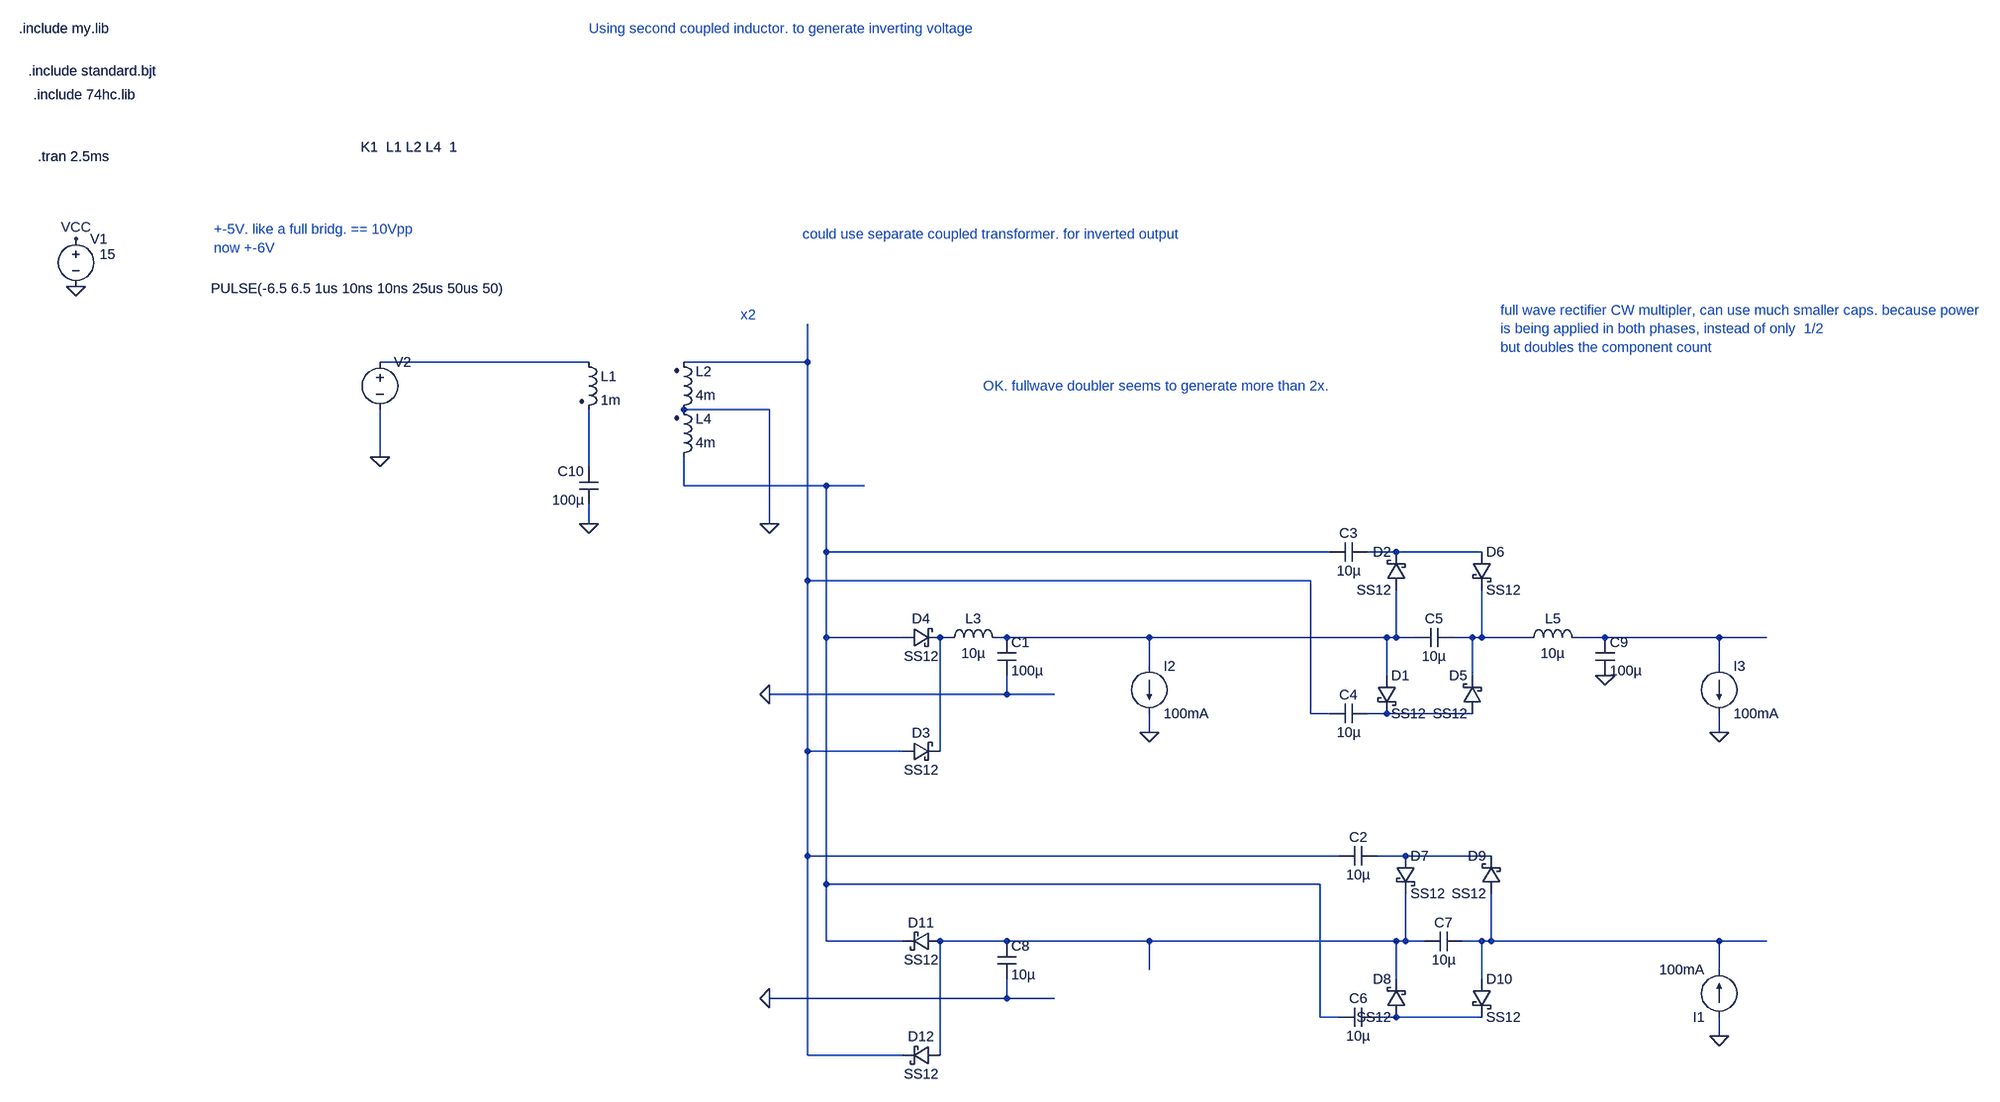
[diagram p0: schematic Draft29.asc]
Draft29.asc, the LTspice schematic file:
Version 4
SHEET 1 5720 1740
WIRE 1504 -128 1152 -128
WIRE 1872 -128 1872 -192
WIRE 1872 -128 1664 -128
WIRE 1808 -48 1664 -48
WIRE 1152 32 1152 -48
WIRE 1504 48 1504 -48
WIRE 1664 80 1664 32
WIRE 1904 80 1664 80
WIRE 1968 80 1904 80
WIRE 1504 144 1504 112
WIRE 1808 144 1808 -48
WIRE 1904 192 1904 80
WIRE 2752 192 1904 192
WIRE 2864 192 2816 192
WIRE 3008 192 2864 192
WIRE 1872 240 1872 -128
WIRE 2720 240 1872 240
WIRE 1904 336 1904 192
WIRE 2032 336 1904 336
WIRE 2112 336 2096 336
WIRE 2208 336 2192 336
WIRE 2448 336 2208 336
WIRE 2848 336 2448 336
WIRE 2864 336 2864 256
WIRE 2864 336 2848 336
WIRE 2896 336 2864 336
WIRE 2992 336 2960 336
WIRE 3008 336 3008 256
WIRE 3008 336 2992 336
WIRE 3088 336 3008 336
WIRE 3216 336 3168 336
WIRE 3408 336 3216 336
WIRE 3488 336 3408 336
WIRE 2448 384 2448 336
WIRE 3408 384 3408 336
WIRE 2848 400 2848 336
WIRE 2992 400 2992 336
WIRE 2208 432 2208 400
WIRE 2208 432 1808 432
WIRE 2288 432 2208 432
WIRE 2720 464 2720 240
WIRE 2752 464 2720 464
WIRE 2848 464 2816 464
WIRE 2992 464 2848 464
WIRE 2448 496 2448 464
WIRE 3408 496 3408 464
WIRE 1872 528 1872 240
WIRE 2032 528 1872 528
WIRE 2096 528 2096 336
WIRE 1872 704 1872 528
WIRE 2768 704 1872 704
WIRE 2880 704 2832 704
WIRE 3024 704 2880 704
WIRE 1904 752 1904 336
WIRE 2736 752 1904 752
WIRE 1904 848 1904 752
WIRE 2032 848 1904 848
WIRE 2208 848 2096 848
WIRE 2448 848 2208 848
WIRE 2864 848 2448 848
WIRE 2880 848 2880 768
WIRE 2880 848 2864 848
WIRE 2912 848 2880 848
WIRE 3008 848 2976 848
WIRE 3024 848 3024 768
WIRE 3024 848 3008 848
WIRE 3408 848 3024 848
WIRE 3488 848 3408 848
WIRE 2448 896 2448 848
WIRE 3408 896 3408 848
WIRE 2864 912 2864 848
WIRE 3008 912 3008 848
WIRE 2208 944 2208 912
WIRE 2208 944 1808 944
WIRE 2288 944 2208 944
WIRE 2736 976 2736 752
WIRE 2768 976 2736 976
WIRE 2864 976 2832 976
WIRE 3008 976 2864 976
WIRE 3408 1008 3408 976
WIRE 1872 1040 1872 704
WIRE 2032 1040 1872 1040
WIRE 2096 1040 2096 848
FLAG 1808 144 0
FLAG 640 -256 0
FLAG 640 -336 VCC
FLAG 3408 496 0
FLAG 1808 432 0
FLAG 2448 496 0
FLAG 1808 944 0
FLAG 3408 1008 0
FLAG 1504 144 0
FLAG 1152 32 0
FLAG 3216 400 0
SYMBOL ind2 1648 48 M180
WINDOW 0 36 80 Left 2
WINDOW 3 36 40 Left 2
SYMATTR InstName L4
SYMATTR Value 4m
SYMATTR Type ind
SYMBOL voltage 640 -352 R0
WINDOW 123 0 0 Left 0
WINDOW 39 0 0 Left 0
WINDOW 3 40 42 Left 2
SYMATTR Value 15
SYMATTR InstName V1
SYMBOL ind2 1488 -144 R0
SYMATTR InstName L1
SYMATTR Value 1m
SYMATTR Type ind
SYMBOL voltage 1152 -144 R0
WINDOW 123 0 0 Left 0
WINDOW 39 0 0 Left 0
WINDOW 3 -285 -108 Left 2
SYMATTR Value PULSE(-6.5 6.5 1us 10ns 10ns 25us 50us 50)
SYMATTR InstName V2
SYMBOL cap 2816 176 R90
WINDOW 0 0 32 VBottom 2
WINDOW 3 32 32 VTop 2
SYMATTR InstName C3
SYMATTR Value 10µ
SYMBOL cap 2816 448 R90
WINDOW 0 0 32 VBottom 2
WINDOW 3 32 32 VTop 2
SYMATTR InstName C4
SYMATTR Value 10µ
SYMBOL cap 2896 352 R270
WINDOW 0 32 32 VTop 2
WINDOW 3 0 32 VBottom 2
SYMATTR InstName C5
SYMATTR Value 10µ
SYMBOL current 3408 384 R0
WINDOW 123 0 0 Left 0
WINDOW 39 0 0 Left 0
SYMATTR InstName I3
SYMATTR Value 100mA
SYMBOL ind2 1648 -32 M180
WINDOW 0 36 80 Left 2
WINDOW 3 36 40 Left 2
SYMATTR InstName L2
SYMATTR Value 4m
SYMATTR Type ind
SYMBOL cap 2192 336 R0
SYMATTR InstName C1
SYMATTR Value 100µ
SYMBOL current 2448 384 R0
WINDOW 123 0 0 Left 0
WINDOW 39 0 0 Left 0
SYMATTR InstName I2
SYMATTR Value 100mA
SYMBOL cap 2192 848 R0
SYMATTR InstName C8
SYMATTR Value 10µ
SYMBOL cap 2832 688 R90
WINDOW 0 0 32 VBottom 2
WINDOW 3 32 32 VTop 2
SYMATTR InstName C2
SYMATTR Value 10µ
SYMBOL cap 2832 960 R90
WINDOW 0 0 32 VBottom 2
WINDOW 3 32 32 VTop 2
SYMATTR InstName C6
SYMATTR Value 10µ
SYMBOL cap 2912 864 R270
WINDOW 0 32 32 VTop 2
WINDOW 3 0 32 VBottom 2
SYMATTR InstName C7
SYMATTR Value 10µ
SYMBOL schottky 2032 352 R270
WINDOW 0 32 32 VTop 2
WINDOW 3 0 32 VBottom 2
SYMATTR InstName D4
SYMATTR Value SS12
SYMATTR Description Diode
SYMATTR Type diode
SYMBOL schottky 2032 544 R270
WINDOW 0 32 32 VTop 2
WINDOW 3 0 32 VBottom 2
SYMATTR InstName D3
SYMATTR Value SS12
SYMATTR Description Diode
SYMATTR Type diode
SYMBOL schottky 2096 832 R90
WINDOW 0 0 32 VBottom 2
WINDOW 3 32 32 VTop 2
SYMATTR InstName D11
SYMATTR Value SS12
SYMATTR Description Diode
SYMATTR Type diode
SYMBOL schottky 2096 1024 R90
WINDOW 0 0 32 VBottom 2
WINDOW 3 32 32 VTop 2
SYMATTR InstName D12
SYMATTR Value SS12
SYMATTR Description Diode
SYMATTR Type diode
SYMBOL schottky 2880 256 R180
WINDOW 0 24 64 Left 2
WINDOW 3 24 0 Left 2
SYMATTR InstName D2
SYMATTR Value SS12
SYMATTR Description Diode
SYMATTR Type diode
SYMBOL schottky 3008 464 R180
WINDOW 0 24 64 Left 2
WINDOW 3 24 0 Left 2
SYMATTR InstName D5
SYMATTR Value SS12
SYMATTR Description Diode
SYMATTR Type diode
SYMBOL schottky 2832 400 R0
SYMATTR InstName D1
SYMATTR Value SS12
SYMATTR Description Diode
SYMATTR Type diode
SYMBOL schottky 2992 192 R0
SYMATTR InstName D6
SYMATTR Value SS12
SYMATTR Description Diode
SYMATTR Type diode
SYMBOL schottky 2864 704 R0
SYMATTR InstName D7
SYMATTR Value SS12
SYMATTR Description Diode
SYMATTR Type diode
SYMBOL schottky 2992 912 R0
SYMATTR InstName D10
SYMATTR Value SS12
SYMATTR Description Diode
SYMATTR Type diode
SYMBOL schottky 2880 976 R180
WINDOW 0 24 64 Left 2
WINDOW 3 24 0 Left 2
SYMATTR InstName D8
SYMATTR Value SS12
SYMATTR Description Diode
SYMATTR Type diode
SYMBOL schottky 3040 768 R180
WINDOW 0 24 64 Left 2
WINDOW 3 24 0 Left 2
SYMATTR InstName D9
SYMATTR Value SS12
SYMATTR Description Diode
SYMATTR Type diode
SYMBOL current 3408 976 R180
WINDOW 123 0 0 Left 0
WINDOW 39 0 0 Left 0
SYMATTR InstName I1
SYMATTR Value 100mA
SYMBOL cap 1520 112 R180
WINDOW 0 24 56 Left 2
WINDOW 3 24 8 Left 2
SYMATTR InstName C10
SYMATTR Value 100µ
SYMBOL ind 2096 352 R270
WINDOW 0 32 56 VTop 2
WINDOW 3 5 56 VBottom 2
SYMATTR InstName L3
SYMATTR Value 10µ
SYMBOL ind 3072 352 R270
WINDOW 0 32 56 VTop 2
WINDOW 3 5 56 VBottom 2
SYMATTR InstName L5
SYMATTR Value 10µ
SYMBOL cap 3200 336 R0
SYMATTR InstName C9
SYMATTR Value 100µ
TEXT 576 -480 Left 2 !.tran 2.5ms
TEXT 1120 -496 Left 2 !K1  L1 L2 L4  1
TEXT 560 -624 Left 2 !.include standard.bjt
TEXT 544 -696 Left 2 !.include my.lib
TEXT 568 -584 Left 2 !.include 74hc.lib
TEXT 872 -352 Left 2 ;+-5V. like a full bridg. == 10Vpp\nnow +-6V
TEXT 3040 -216 Left 2 ;full wave rectifier CW multipler, can use much smaller caps. because power\nis being applied in both phases, instead of only  1/2\nbut doubles the component count
TEXT 1504 -696 Left 2 ;Using second coupled inductor. to generate inverting voltage
TEXT 2168 -88 Left 2 ;OK. fullwave doubler seems to generate more than 2x.
TEXT 1760 -208 Left 2 ;x2
TEXT 1864 -344 Left 2 ;could use separate coupled transformer. for inverted output

The netlist it stands for:
* Draft29.asc
L4 N004 0 4m
V1 VCC 0 15
L1 N001 N003 1m
V2 N001 0 PULSE(-6.5 6.5 1us 10ns 10ns 25us 50us 50)
C3 N005 N004 10µ
C4 N010 N002 10µ
C5 N007 N008 10µ
I3 N009 0 100mA
L2 0 N002 4m
C1 N007 0 100µ
I2 N007 0 100mA
C8 N012 0 10µ
C2 N011 N002 10µ
C6 N014 N004 10µ
C7 N012 N013 10µ
D4 N004 N006 SS12
D3 N002 N006 SS12
D11 N012 N004 SS12
D12 N012 N002 SS12
D2 N007 N005 SS12
D5 N010 N008 SS12
D1 N007 N010 SS12
D6 N005 N008 SS12
D7 N011 N012 SS12
D10 N013 N014 SS12
D8 N014 N012 SS12
D9 N013 N011 SS12
I1 0 N013 100mA
C10 0 N003 100µ
L3 N006 N007 10µ
L5 N008 N009 10µ
C9 N009 0 100µ
.model D D
.lib standard.dio
.tran 2.5ms
K1  L1 L2 L4  1
.include standard.bjt
.include my.lib
.include 74hc.lib
* +-5V. like a full bridg. == 10Vpp
* now +-6V
* full wave rectifier CW multipler, can use much smaller caps. because power
* is being applied in both phases, instead of only  1/2
* but doubles the component count
* Using second coupled inductor. to generate inverting voltage
* OK. fullwave doubler seems to generate more than 2x.
* x2
* could use separate coupled transformer. for inverted output
.backanno
.end